# Altium schematic sheet NSTRI.SchDoc
size A3
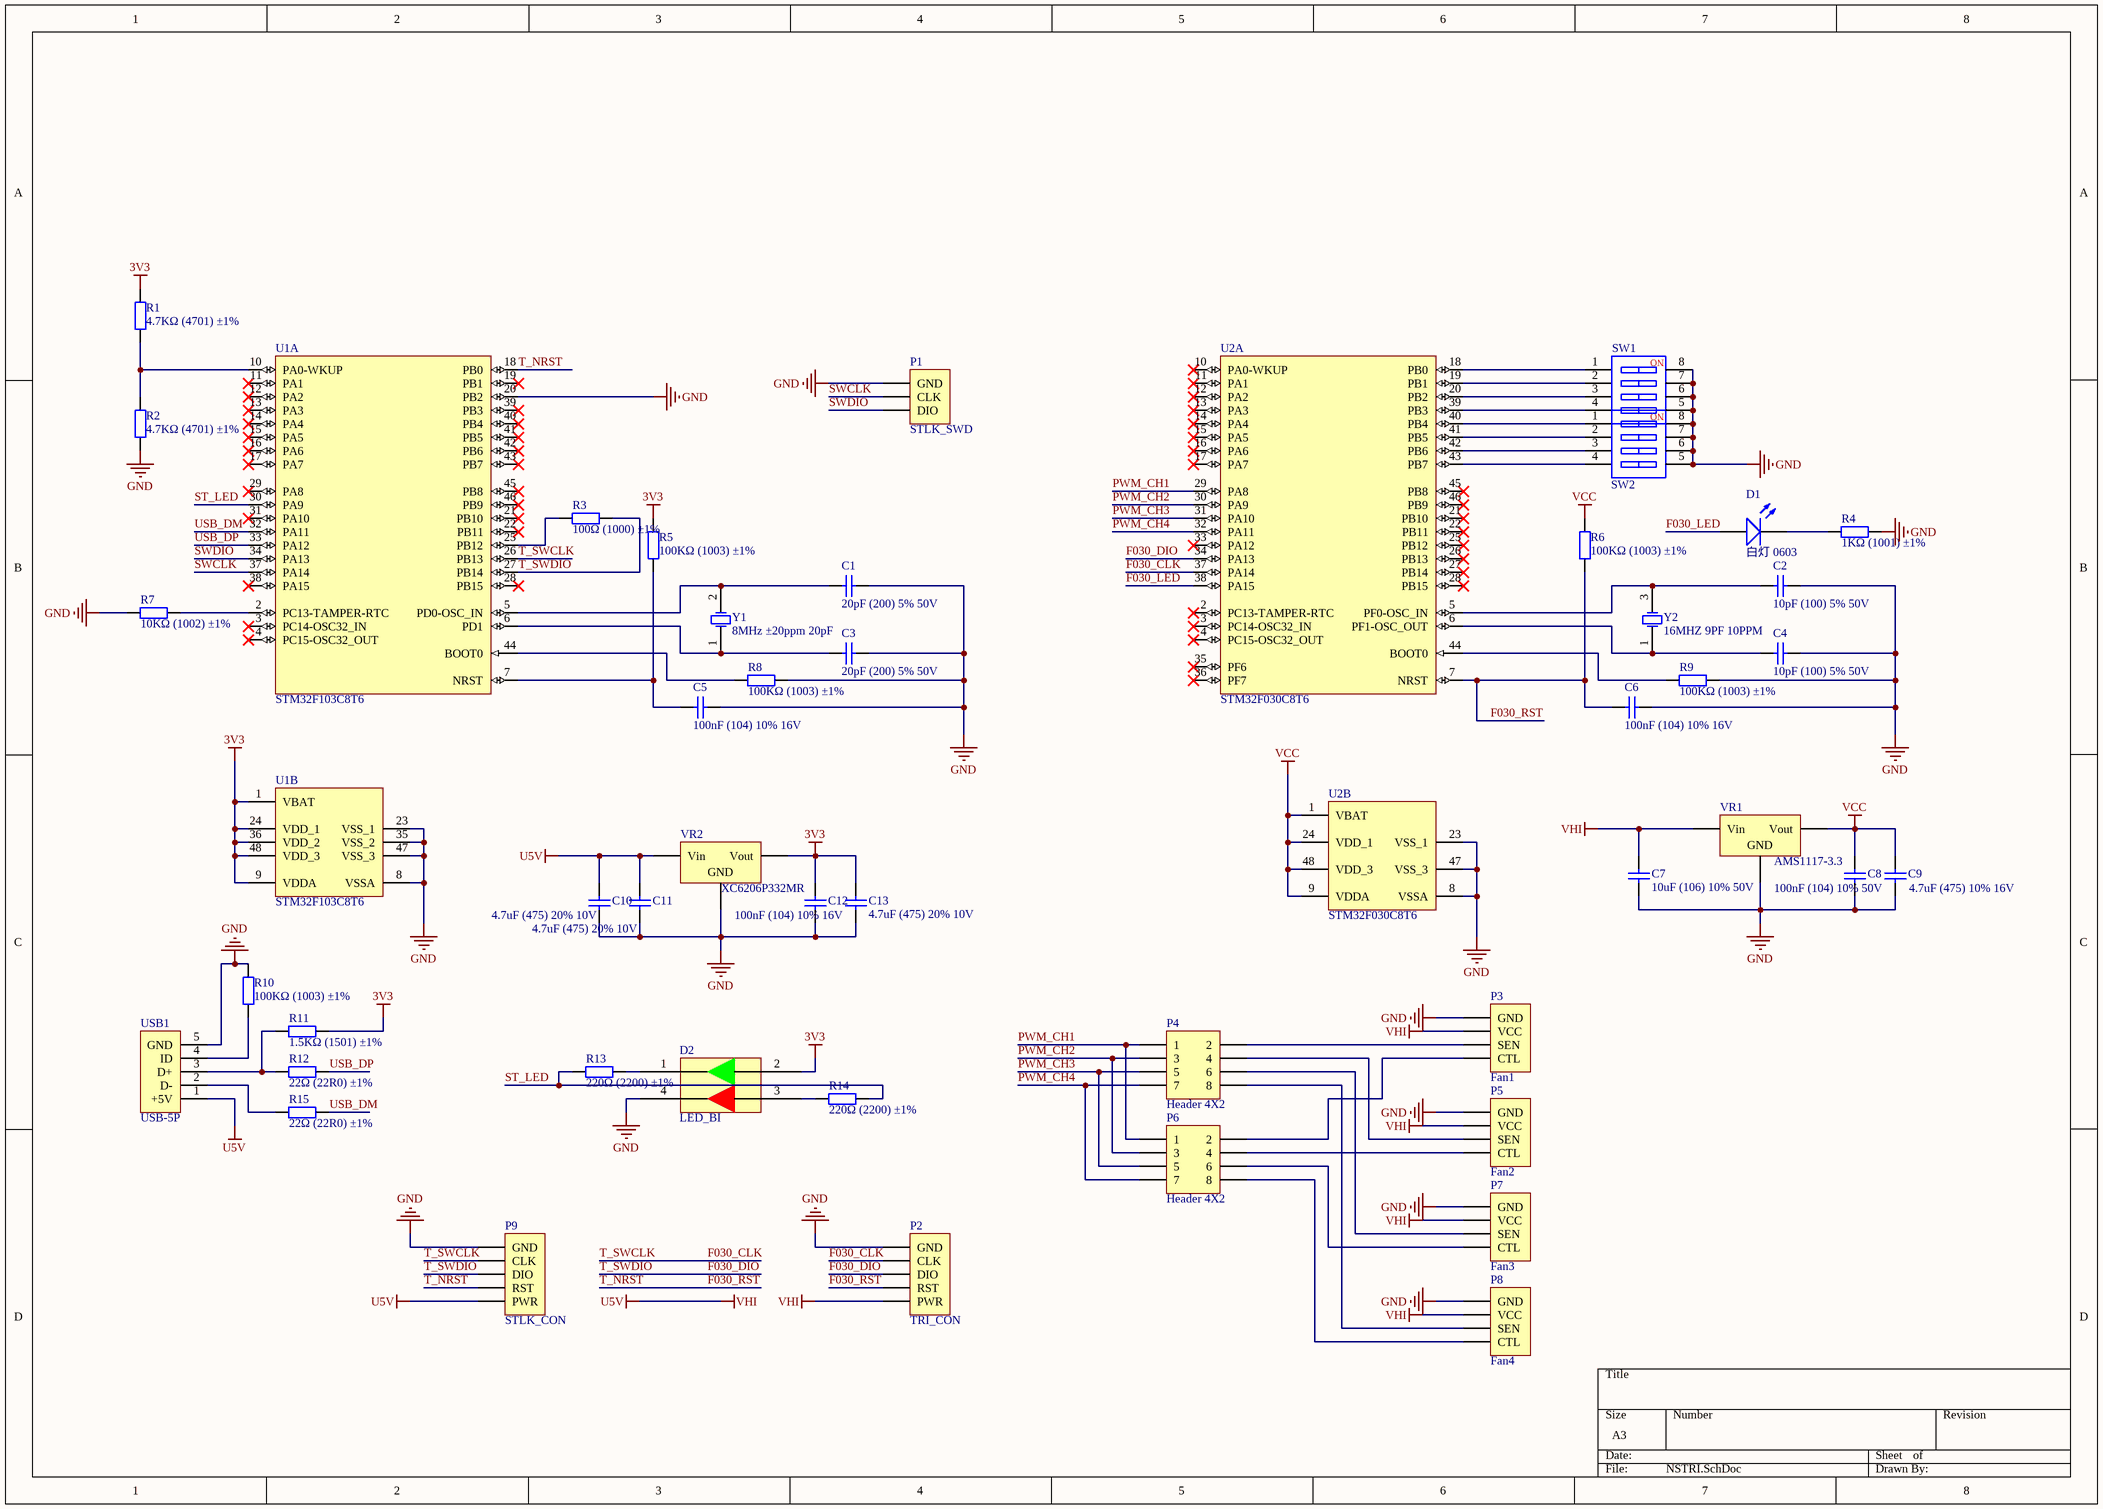
[diagram p0: NSTRI.SchDoc]

## Parts
C1  20pF (200) 5% 50V  [0402_C]
C2  10pF (100) 5% 50V  [0402_C]
C3  20pF (200) 5% 50V  [0402_C]
C4  10pF (100) 5% 50V  [0402_C]
C5  100nF (104) 10% 16V  [0402_C]
C6  100nF (104) 10% 16V  [0402_C]
C7  10uF (106) 10% 50V  [1206_C]
C8  100nF (104) 10% 50V  [0603_C]
C9  4.7uF (475) 10% 16V  [0603_C]
C10  4.7uF (475) 20% 10V  [0402_C]
C11  4.7uF (475) 20% 10V  [0402_C]
C12  100nF (104) 10% 16V  [0402_C]
C13  4.7uF (475) 20% 10V  [0402_C]
D1  白灯 0603  [0603_LED_S1]
D2  LED_BI  [LED_BI]
P1  STLK_SWD  [HDR1X3]
P2  TRI_CON  [HDR1X5]
P3  Fan1  [HDR1X4]
P4  Header 4X2  [HDR2X4]
P5  Fan2  [HDR1X4]
P6  Header 4X2  [HDR2X4]
P7  Fan3  [HDR1X4]
P8  Fan4  [HDR1X4]
P9  STLK_CON  [HDR1X5]
R1  4.7KΩ (4701) ±1%  [0402_R]
R2  4.7KΩ (4701) ±1%  [0402_R]
R3  100Ω (1000) ±1%  [0402_R]
R4  1KΩ (1001) ±1%  [0402_R]
R5  100KΩ (1003) ±1%  [0402_R]
R6  100KΩ (1003) ±1%  [0402_R]
R7  10KΩ (1002) ±1%  [0402_R]
R8  100KΩ (1003) ±1%  [0402_R]
R9  100KΩ (1003) ±1%  [0402_R]
R10  100KΩ (1003) ±1%  [0402_R]
R11  1.5KΩ (1501) ±1%  [0402_R]
R12  22Ω (22R0) ±1%  [0402_R]
R13  220Ω (2200) ±1%  [0402_R]
R14  220Ω (2200) ±1%  [0402_R]
R15  22Ω (22R0) ±1%  [0402_R]
SW1  CSW-4P  [CSW DIP-4P]  (value not drawn)
SW2  CSW-4P  [CSW DIP-4P]  (value not drawn)
U1  STM32F103C8T6  [LQFP-48_7x7x05P]  (parts A,B of 2)
U2  STM32F030C8T6  [LQFP-48_7x7x05P]  (parts A,B of 2)
USB1  USB-5P  [USB-MICRO_D]
VR1  AMS1117-3.3  [SOT-223]
VR2  XC6206P332MR  [SOT-23-3L]
Y1  8MHz ±20ppm 20pF  [SMD-5032_2P]
Y2  16MHZ 9PF 10PPM  [SMD-3225_4P]

## Nets
3V3: C12.2 C13.2 D2.2 R1.2 R5.2 R11.2 U1.1(VBAT) U1.9(VDDA) U1.24(VDD_1) U1.36(VDD_2) U1.48(VDD_3) VR2.2(Vout)
GND: C1.2 C2.2 C3.2 C4.2 C5.1 C6.1 C7.1 C8.1 C9.1 C10.1 C11.1 C12.1 C13.1 D2.4 P1.1(GND) P2.1(GND) P3.1(GND) P5.1(GND) P7.1(GND) P8.1(GND) P9.1(GND) R2.1 R4.2 R7.1 R8.2 R9.2 R10.2 SW1.5 SW1.6 SW1.7 SW1.8 SW2.5 SW2.6 SW2.7 SW2.8 U1.8(VSSA) U1.20(PB2) U1.23(VSS_1) U1.35(VSS_2) U1.47(VSS_3) U2.8(VSSA) U2.23(VSS_1) U2.47(VSS_3) USB1.5(GND) VR1.1(GND) VR2.1(GND)
U5V: C7.2 C10.2 C11.2 P2.5(PWR) P3.2(VCC) P5.2(VCC) P7.2(VCC) P8.2(VCC) P9.5(PWR) USB1.1(+5V) VR1.3(Vin) VR2.3(Vin)  [also labelled VHI]
VCC: C8.2 C9.2 R6.2 U2.1(VBAT) U2.9(VDDA) U2.24(VDD_1) U2.48(VDD_3) VR1.2(Vout)
F030_CLK: P2.2(CLK) P9.2(CLK) U1.26(PB13) U2.37(PA14)  [also labelled T_SWCLK]
F030_DIO: P2.3(DIO) P9.3(DIO) R3.2 U1.27(PB14) U2.34(PA13)  [also labelled T_SWDIO]
F030_LED: D1.A U2.38(PA15)
F030_RST: C6.2 P2.4(RST) P9.4(RST) R6.1 U1.18(PB0) U2.7(NRST)  [also labelled T_NRST]
PWM_CH1: P4.1 P6.1 U2.29(PA8)
PWM_CH2: P4.3 P6.3 U2.30(PA9)
PWM_CH3: P4.5 P6.5 U2.31(PA10)
PWM_CH4: P4.7 P6.7 U2.32(PA11)
ST_LED: R13.1 R14.2 U1.30(PA9)
SWCLK: P1.2(CLK) U1.37(PA14)
SWDIO: P1.3(DIO) U1.34(PA13)
USB_DM: R15.2 U1.32(PA11)
USB_DP: R12.2 U1.33(PA12)
NetC1_1: C1.1 U1.5(PD0-OSC_IN) Y1.2(OSC2)
NetC2_1: C2.1 U2.5(PF0-OSC_IN) Y2.3(OSC2)
NetC3_1: C3.1 U1.6(PD1) Y1.1(OSC1)
NetC4_1: C4.1 U2.6(PF1-OSC_OUT) Y2.1(OSC1)
NetC5_2: C5.2 R5.1 U1.7(NRST)
NetD1_K: D1.K R4.1
NetD2_1: D2.1 R13.2
NetD2_3: D2.3 R14.1
NetP3_3: P3.3(SEN) P4.2
NetP3_4: P3.4(CTL) P6.2
NetP4_4: P4.4 P5.3(SEN)
NetP4_6: P4.6 P7.3(SEN)
NetP4_8: P4.8 P8.3(SEN)
NetP5_4: P5.4(CTL) P6.4
NetP6_6: P6.6 P7.4(CTL)
NetP6_8: P6.8 P8.4(CTL)
NetR1_1: R1.1 R2.2 U1.10(PA0-WKUP)
NetR3_1: R3.1 U1.25(PB12)
NetR7_2: R7.2 U1.2(PC13-TAMPER-RTC)
NetR8_1: R8.1 U1.44(BOOT0)
NetR9_1: R9.1 U2.44(BOOT0)
NetR10_1: R10.1 USB1.4(ID)
NetR11_1: R11.1 R12.1 USB1.3(D+)
NetR15_1: R15.1 USB1.2(D-)
NetSW1_1: SW1.1 U2.18(PB0)
NetSW1_2: SW1.2 U2.19(PB1)
NetSW1_3: SW1.3 U2.20(PB2)
NetSW1_4: SW1.4 U2.39(PB3)
NetSW2_1: SW2.1 U2.40(PB4)
NetSW2_2: SW2.2 U2.41(PB5)
NetSW2_3: SW2.3 U2.42(PB6)
NetSW2_4: SW2.4 U2.43(PB7)

Not connected (* = marked no-connect by the designer): U1 3(PC14-OSC32_IN)* 4(PC15-OSC32_OUT)* 11(PA1)* 12(PA2)* 13(PA3)* 14(PA4)* 15(PA5)* 16(PA6)* 17(PA7)* 19(PB1)* 21(PB10)* 22(PB11)* 28(PB15)* 29(PA8)* 31(PA10)* 38(PA15)* 39(PB3)* 40(PB4)* 41(PB5)* 42(PB6)* 43(PB7)* 45(PB8)* 46(PB9)*; U2 2(PC13-TAMPER-RTC)* 3(PC14-OSC32_IN)* 4(PC15-OSC32_OUT)* 10(PA0-WKUP)* 11(PA1)* 12(PA2)* 13(PA3)* 14(PA4)* 15(PA5)* 16(PA6)* 17(PA7)* 21(PB10)* 22(PB11)* 25(PB12)* 26(PB13)* 27(PB14)* 28(PB15)* 33(PA12)* 35(PF6)* 36(PF7)* 45(PB8)* 46(PB9)*

## Notes on the sheet
- (in symbol CSW-4P) NO

## Library data of the parts
C1 C3 = 0402 20pF (200) 5% 50V: 贴片电容; ComponentLink1Description: 供应商链接; ComponentLink1URL: http://www.szlcsc.com/product/details_1906.html; Package: 0402; Supplier: LC; SuppliersPartNumber: C1554
C2 C4 = 0402 10pF (100) 5% 50V: 贴片电容; ComponentLink1Description: 供应商链接; ComponentLink1URL: http://www.szlcsc.com/product/details_33914.html; Package: 0402; Supplier: LC; SuppliersPartNumber: C32949
C5 C6 C12 = 0402 100nF (104) 10% 16V: 贴片电容; ComponentLink1Description: 供应商链接; ComponentLink1URL: http://www.szlcsc.com/product/details_1877.html; Package: 0402; Supplier: LC; SuppliersPartNumber: C1525
C7 = 1206 10uF (106) 10% 50V: 贴片电容; ComponentLink1Description: 供应商链接; ComponentLink1URL: http://www.szlcsc.com/product/details_14236.html; Package: 1206; Supplier: LC; SuppliersPartNumber: C13585
C8 = 0603 100nF (104) 10% 50V: 贴片电容; ComponentLink1Description: 供应商链接; ComponentLink1URL: http://www.szlcsc.com/product/details_15331.html; Package: 0603; Supplier: LC; SuppliersPartNumber: C14663
C9 = 0603 4.7uF (475) 10% 16V: 贴片电容; ComponentLink1Description: 供应商链接; ComponentLink1URL: http://www.szlcsc.com/product/details_20375.html; Package: 0603; Supplier: LC; SuppliersPartNumber: C19666
C10 C11 C13 = 0402 4.7uF (475) 20% 10V: 贴片电容; ComponentLink1Description: 供应商链接; ComponentLink1URL: http://www.szlcsc.com/product/details_24469.html; Package: 0402; Supplier: LC; SuppliersPartNumber: C23733
D1 = 0603 白灯: 发光二极管; ComponentLink1Description: 供应商链接; ComponentLink1URL: http://www.szlcsc.com/product/details_2663.html; Package: 0603; Supplier: LC; SuppliersPartNumber: C2290
P1 = Header 3: Header, 3-Pin; LatestRevisionDate: 17-Jul-2002; LatestRevisionNote: Re-released for DXP Platform.; Publisher: Altium Limited
P2 P9 = Header 5: Header, 5-Pin; LatestRevisionDate: 17-Jul-2002; LatestRevisionNote: Re-released for DXP Platform.; Publisher: Altium Limited
P3 P5 P7 P8 = Header 4: Header, 4-Pin; LatestRevisionDate: 17-Jul-2002; LatestRevisionNote: Re-released for DXP Platform.; Publisher: Altium Limited
P4 P6 = Header 4X2: Header, 4-Pin, Dual row; LatestRevisionDate: 17-Jul-2002; LatestRevisionNote: Re-released for DXP Platform.; Publisher: Altium Limited
R1 R2 = 0402 4.7KΩ (4701) 1%: 贴片电阻; ComponentLink1Description: 供应商链接; ComponentLink1URL: http://www.szlcsc.com/product/details_26643.html; Package: 0402; Supplier: LC; SuppliersPartNumber: C25900
R3 = 0402 100Ω (1000) 1%: 贴片电阻; ComponentLink1Description: 供应商链接; ComponentLink1URL: http://www.szlcsc.com/product/details_25819.html; Package: 0402; Supplier: LC; SuppliersPartNumber: C25076
R4 = 0402 1KΩ (1001) 1%: 贴片电阻; ComponentLink1Description: 供应商链接; ComponentLink1URL: http://www.szlcsc.com/product/details_12256.html; Package: 0402; Supplier: LC; SuppliersPartNumber: C11702
R5 R6 R8-R10 = 0402 100KΩ (1003) 1%: 贴片电阻; ComponentLink1Description: 供应商链接; ComponentLink1URL: http://www.szlcsc.com/product/details_26484.html; Package: 0402; Supplier: LC; SuppliersPartNumber: C25741
R7 = 0402 10KΩ (1002) 1%: 贴片电阻; ComponentLink1Description: 供应商链接; ComponentLink1URL: http://www.szlcsc.com/product/details_26487.html; Package: 0402; Supplier: LC; SuppliersPartNumber: C25744
R11 = 0402 1.5KΩ (1501) 1%: 贴片电阻; ComponentLink1Description: 供应商链接; ComponentLink1URL: http://www.szlcsc.com/product/details_26610.html; Package: 0402; Supplier: LC; SuppliersPartNumber: C25867
R12 R15 = 0402 22Ω (22R0) 1%: 贴片电阻; ComponentLink1Description: 供应商链接; ComponentLink1URL: http://www.szlcsc.com/product/details_25835.html; Package: 0402; Supplier: LC; SuppliersPartNumber: C25092
R13 R14 = 0402 220Ω (2200) 1%: 贴片电阻; ComponentLink1Description: 供应商链接; ComponentLink1URL: http://www.szlcsc.com/product/details_25834.html; Package: 0402; Supplier: LC; SuppliersPartNumber: C25091
SW1 SW2 = CSW-4P: 4路编码开关; 版权归属: 源创客; BOM名称: 4路编码开关; 学习资源: www.ooocke.com
U1 = STM32F103C8T6: ARM; ComponentLink1Description: 供应商链接; ComponentLink1URL: http://www.szlcsc.com/product/details_9243.html; Package: LQFP-48_7x7x05P; Supplier: LC; SuppliersPartNumber: C8734
U2 = STM32F030C8T6: ARM; ComponentLink1Description: 供应商链接; ComponentLink1URL: http://www.szlcsc.com/product/details_9243.html; Package: LQFP-48_7x7x05P; Supplier: LC; SuppliersPartNumber: C8734
USB1 = USB-5P: 微型USB母座; 版权归属: 源创客; BOM名称: 微型USB母座; 学习资源: www.ooocke.com
VR1 = SOT-223 AMS1117-3.3: 低压差线性稳压(LDO); ComponentLink1Description: 供应商链接; ComponentLink1URL: http://www.szlcsc.com/product/details_6652.html; Package: SOT-223; Supplier: LC; SuppliersPartNumber: C6186
VR2 = SOT-23 XC6206P332MR: 低压差线性稳压(LDO); ComponentLink1Description: 供应商链接; ComponentLink1URL: http://www.szlcsc.com/product/details_5896.html; Package: SOT-23; Supplier: LC; SuppliersPartNumber: C5446
Y1 = SMD-5032_2P 8MHz 20ppm 20pF: 贴片晶振; ComponentLink1Description: 供应商链接; ComponentLink1URL: http://www.szlcsc.com/product/details_117214.html; Package: SMD-5032_2P; Supplier: LC; SuppliersPartNumber: C115962
Y2 = SMD-3225_4P  16MHZ 9PF 10PPM: 贴片晶振; ComponentLink1Description: 供应商链接; ComponentLink1URL: http://www.szlcsc.com/product/details_14393.html; Package: SMD-3225_4P; Supplier: LC; SuppliersPartNumber: C13738